# EasyEDA schematic GSE Analog Remote TOP Schematic v1 EasyEDA.json
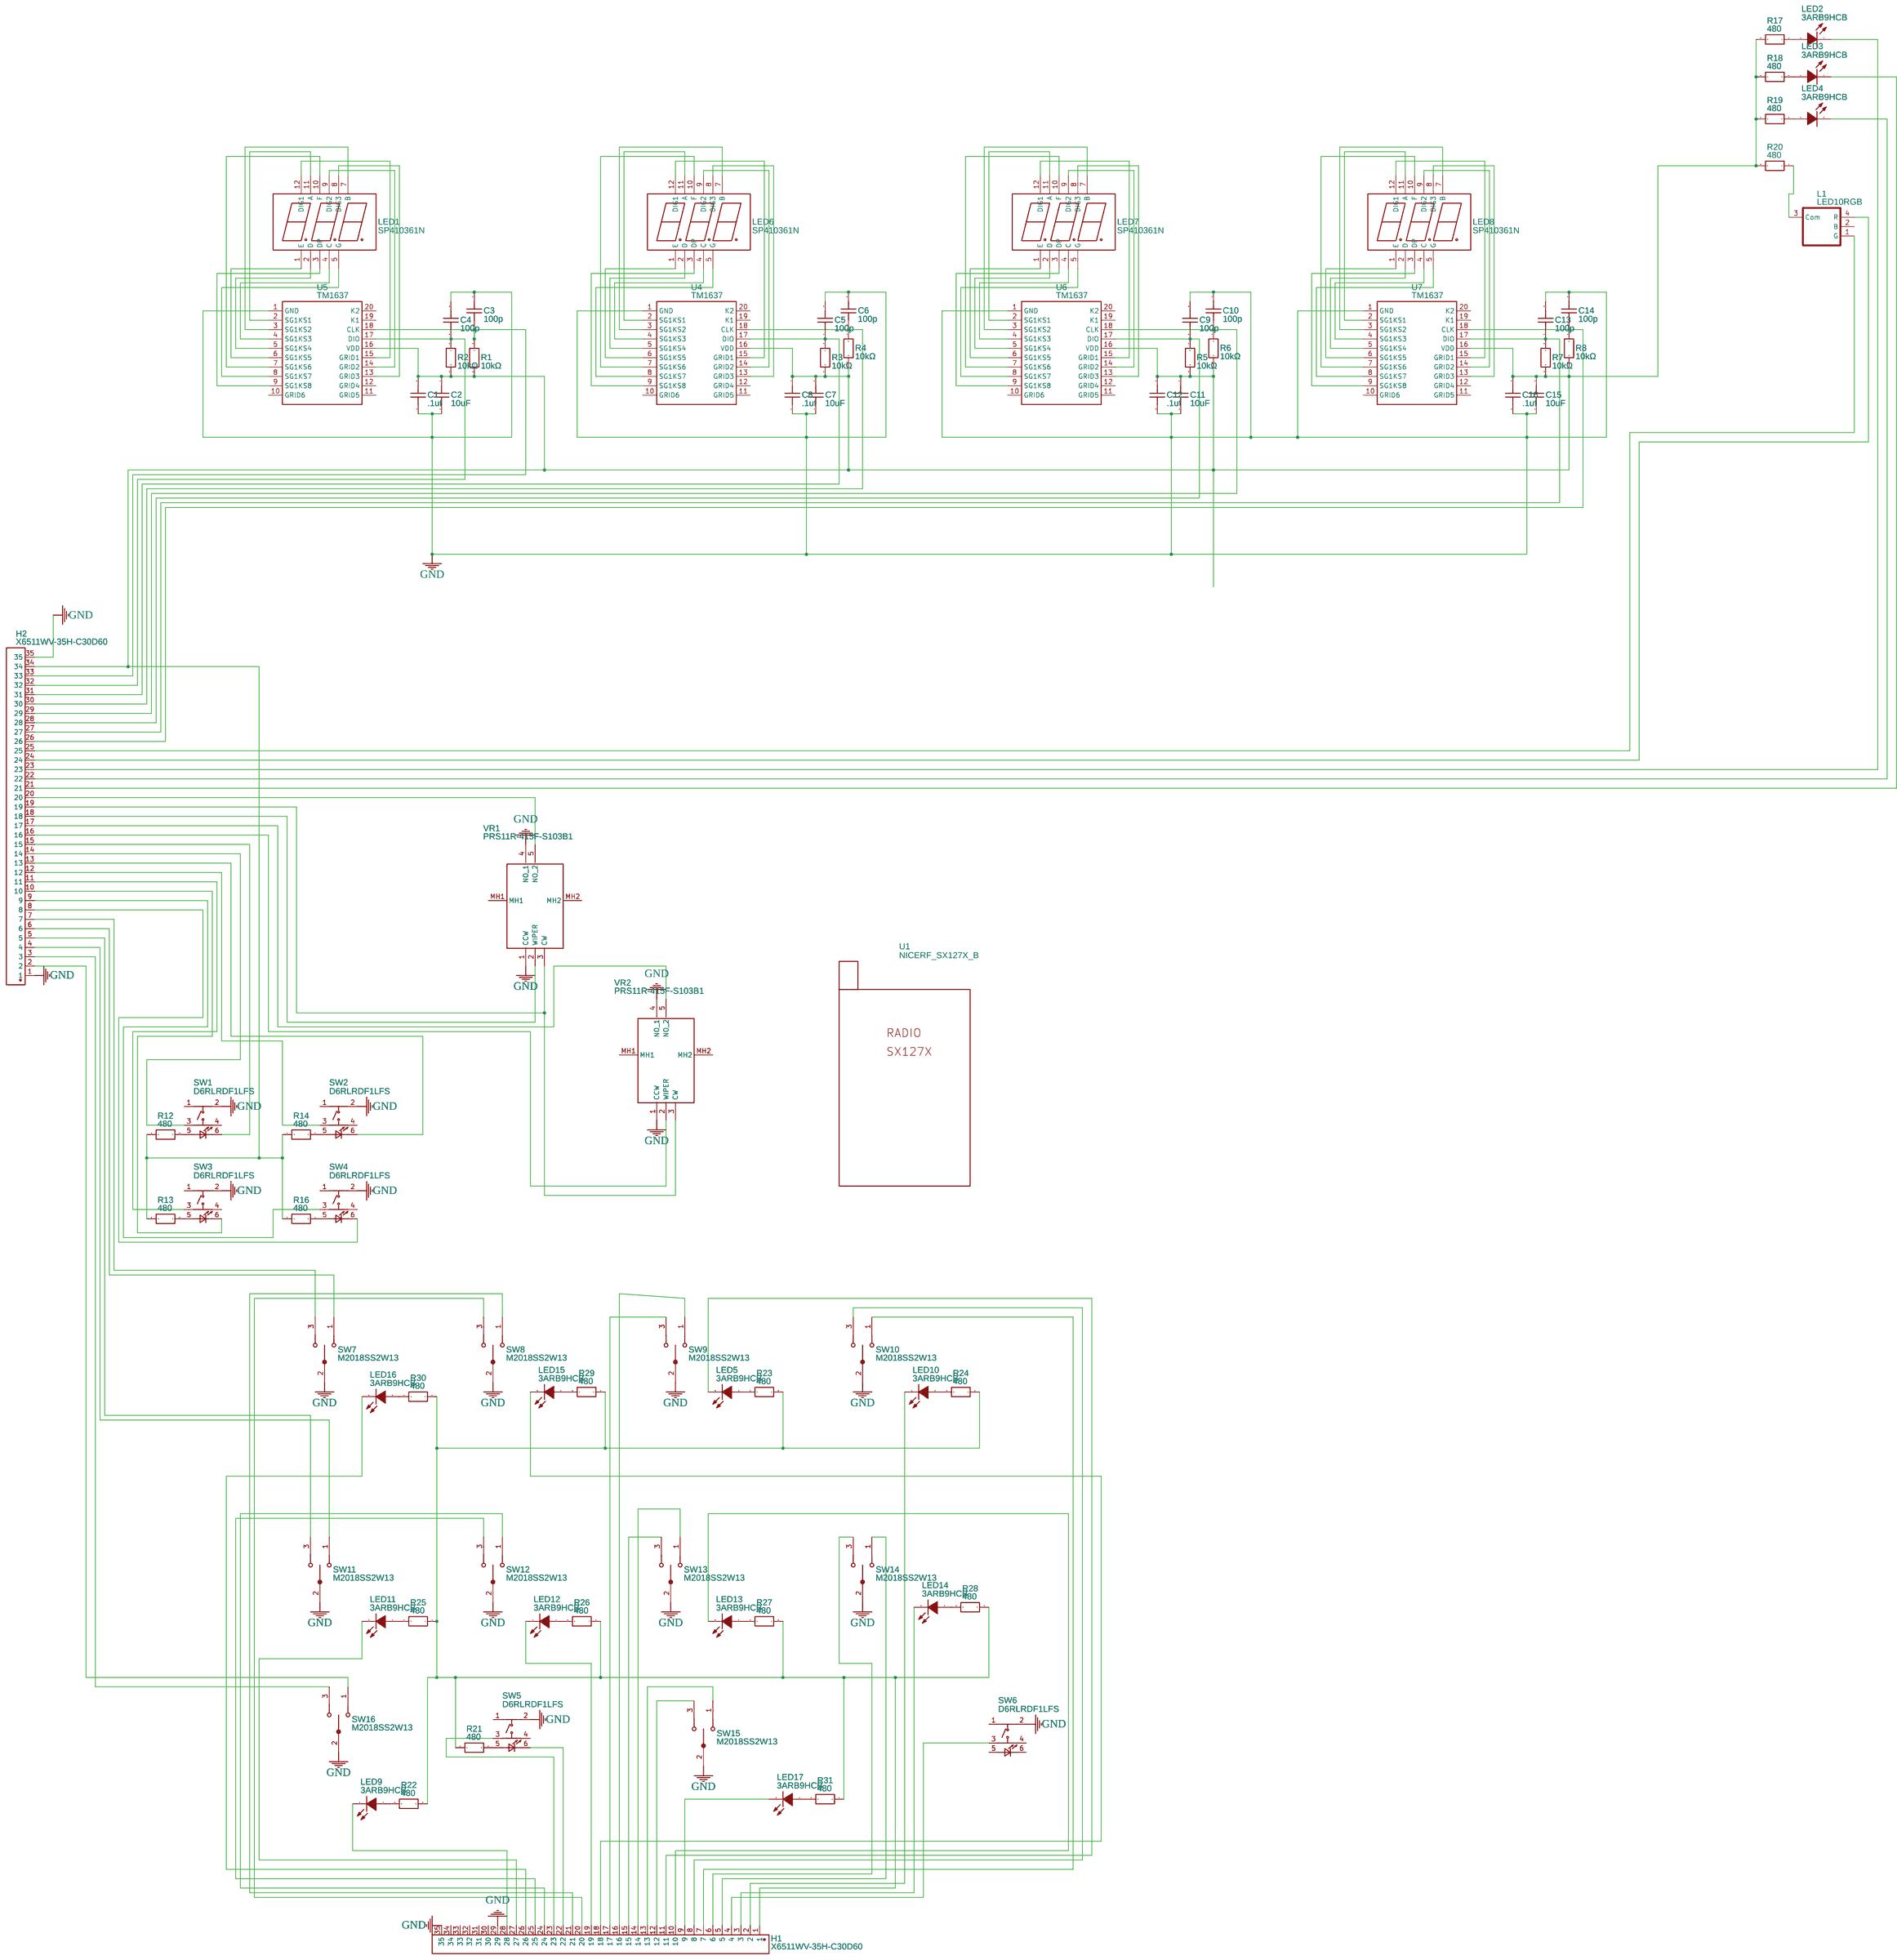
[diagram p0: schematic sheet]

## Parts
C1  .1uf  [C0603]
C2  10uF  [C0603]
C3  100p  [C0603]
C4  100p  [C0603]
C5  100p  [C0603]
C6  100p  [C0603]
C7  10uF  [C0603]
C8  .1uf  [C0603]
C9  100p  [C0603]
C10  100p  [C0603]
C11  10uF  [C0603]
C12  .1uf  [C0603]
C13  100p  [C0603]
C14  100p  [C0603]
C15  10uF  [C0603]
C16  .1uf  [C0603]
H1  X6511WV-35H-C30D60  [HDR-TH_35P-P2.54-V-M]
H2  X6511WV-35H-C30D60  [HDR-TH_35P-P2.54-V-M]
L1  LED10RGB  [LED10MM_RGB]
LED1  SP410361N  [LED-SEG-TH_11P-L22.0-W14.0-P2.54-S10.16-BL]
LED2  3ARB9HCB  [LED-3MM]
LED3  3ARB9HCB  [LED-3MM]
LED4  3ARB9HCB  [LED-3MM]
LED5  3ARB9HCB  [LED-3MM]
LED6  SP410361N  [LED-SEG-TH_11P-L22.0-W14.0-P2.54-S10.16-BL]
LED7  SP410361N  [LED-SEG-TH_11P-L22.0-W14.0-P2.54-S10.16-BL]
LED8  SP410361N  [LED-SEG-TH_11P-L22.0-W14.0-P2.54-S10.16-BL]
LED9  3ARB9HCB  [LED-3MM]
LED10  3ARB9HCB  [LED-3MM]
LED11  3ARB9HCB  [LED-3MM]
LED12  3ARB9HCB  [LED-3MM]
LED13  3ARB9HCB  [LED-3MM]
LED14  3ARB9HCB  [LED-3MM]
LED15  3ARB9HCB  [LED-3MM]
LED16  3ARB9HCB  [LED-3MM]
LED17  3ARB9HCB  [LED-3MM]
R1  10kΩ  [R0603]
R2  10kΩ  [R0603]
R3  10kΩ  [R0603]
R4  10kΩ  [R0603]
R5  10kΩ  [R0603]
R6  10kΩ  [R0603]
R7  10kΩ  [R0603]
R8  10kΩ  [R0603]
R12  480  [R0805]
R13  480  [R0805]
R14  480  [R0805]
R16  480  [R0805]
R17  480  [R0805]
R18  480  [R0805]
R19  480  [R0805]
R20  480  [R0805]
R21  480  [R0805]
R22  480  [R0805]
R23  480  [R0805]
R24  480  [R0805]
R25  480  [R0805]
R26  480  [R0805]
R27  480  [R0805]
R28  480  [R0805]
R29  480  [R0805]
R30  480  [R0805]
R31  480  [R0805]
SW1  D6RLRDF1LFS  [SW-TH_D6RLRDF1LFS]
SW2  D6RLRDF1LFS  [SW-TH_D6RLRDF1LFS]
SW3  D6RLRDF1LFS  [SW-TH_D6RLRDF1LFS]
SW4  D6RLRDF1LFS  [SW-TH_D6RLRDF1LFS]
SW5  D6RLRDF1LFS  [SW-TH_D6RLRDF1LFS]
SW6  D6RLRDF1LFS  [SW-TH_D6RLRDF1LFS]
SW7  M2018SS2W13  [M2012SS2W13]
SW8  M2018SS2W13  [M2012SS2W13]
SW9  M2018SS2W13  [M2012SS2W13]
SW10  M2018SS2W13  [M2012SS2W13]
SW11  M2018SS2W13  [M2012SS2W13]
SW12  M2018SS2W13  [M2012SS2W13]
SW13  M2018SS2W13  [M2012SS2W13]
SW14  M2018SS2W13  [M2012SS2W13]
SW15  M2018SS2W13  [M2012SS2W13]
SW16  M2018SS2W13  [M2012SS2W13]
U1  NICERF_SX127X_B  [NICERF_LORA611PRO_FP_B]
U4  TM1637  [SOP-20_L12.8-W7.5-P1.27-LS10.4-BL]
U5  TM1637  [SOP-20_L12.8-W7.5-P1.27-LS10.4-BL]
U6  TM1637  [SOP-20_L12.8-W7.5-P1.27-LS10.4-BL]
U7  TM1637  [SOP-20_L12.8-W7.5-P1.27-LS10.4-BL]
VR1  PRS11R-415F-S103B1  [PRS11R-415F-S103B1FP]
VR2  PRS11R-415F-S103B1  [PRS11R-415F-S103B1FP]

## Library data of the parts
C1-C16 = 10UF: Contributor: LCSC; Supplier: LCSC; Supplier Part: C15415; Manufacturer: SAMSUNG(三星); JLCPCB Part Class: Extended Part
H1 H2 = X6511WV-35H-C30D60: Contributor: LCSC; Supplier: LCSC; Supplier Part: C2883694; Manufacturer: XKB Connectivity(中国星坤)
L1 = LED10RGB: Contributor: sorinfxdx
LED1 LED6-LED8 = SP410361N: Contributor: LCSC; Supplier: LCSC; Supplier Part: C98923; Manufacturer: ARKLED(方舟); JLCPCB Part Class: Extended Part
LED2-LED5 LED9-LED17 = 3ARB9HCB: Supplier: LCSC; Manufacturer: KENTO; Supplier Part: C42016
R1-R8 = RE0603FRE0710KL: Contributor: LCSC; Supplier: LCSC; Supplier Part: C723398; Manufacturer: YAGEO(国巨); JLCPCB Part Class: Extended Part
R12-R14 R16-R31 = ERA6AEB202V: Supplier: LCSC; Supplier Part: C417117; Manufacturer: PANASONIC; Contributor: LCSC
SW1-SW6 = D6RLRDF1LFS: Contributor: LCSC; Supplier: LCSC; Supplier Part: C966901; Manufacturer: C&K; JLCPCB Part Class: Extended Part
SW7-SW16 = M2018SS2W13: Contributor: Tomasejackson
U1 = NICERF_SX127X_B: Contributor: mbrinker
U4-U7 = TM1637: Contributor: Tinkerforge; Supplier: LCSC; Manufacturer: TM(天微); Supplier Part: C20001; JLCPCB Part Class: Extended Part
VR1 VR2 = PRS11R-415F-S103B1: Contributor: mbrinker; Manufacturer: BOURNS; link: https://www.newark.com/bourns/prs11r-415f-s103b1/rotary-potentiometer-10kohm-0/dp/65AH0673

## Nets
GND: C1.1 C2.1 C3.2 C4.2 C5.2 C6.2 C7.1 C8.1 C9.2 C10.2 C11.1 C12.1 C13.2 C14.2 C15.1 C16.1 H1.29 H1.35 H2.1 H2.35 SW1.2 SW2.2 SW3.2 SW4.2 SW5.2 SW6.2 SW7.2 SW8.2 SW9.2 SW10.2 SW11.2 SW12.2 SW13.2 SW14.2 SW15.2 SW16.2 U4.1(GND) U5.1(GND) U6.1(GND) U7.1(GND) VR1.1(CCW) VR1.4(NO_1) VR2.1(CCW) VR2.4(NO_1)
Net-(C1-2): C1.2 C2.2 C7.2 C8.2 C11.2 C12.2 C15.2 C16.2 H2.34 R1.2 R2.2 R3.2 R4.2 R5.2 R6.2 R7.2 R8.2 R12.2 R13.2 R14.2 R16.2 R17.2 R18.2 R19.2 R20.2 U4.16(VDD) U5.16(VDD) U6.16(VDD) U7.16(VDD)
Net-(C3-1): C3.1 H2.33 R1.1 U5.18(CLK)
Net-(C4-1): C4.1 H2.32 R2.1 U5.17(DIO)
Net-(C5-1): C5.1 H2.31 R3.1 U4.17(DIO)
Net-(C6-1): C6.1 H2.30 R4.1 U4.18(CLK)
Net-(C9-1): C9.1 H2.28 R5.1 U6.17(DIO)
Net-(C10-1): C10.1 H2.29 R6.1 U6.18(CLK)
Net-(C13-1): C13.1 H2.27 R7.1 U7.17(DIO)
Net-(C14-1): C14.1 H2.26 R8.1 U7.18(CLK)
Net-(H1-1): H1.1 R21.2 R22.1 R23.1 R24.1 R25.1 R26.1 R27.1 R28.1 R29.1 R30.1 R31.1
Net-(H1-2): H1.2 LED10.2(K)
Net-(H1-3): H1.3 LED14.2(K)
Net-(H1-4): H1.4 SW6.3
Net-(H1-5): H1.5 SW14.1
Net-(H1-6): H1.6 SW14.3
Net-(H1-7): H1.7 SW10.1
Net-(H1-8): H1.8 SW10.3
Net-(H1-9): H1.9 LED17.2(K)
Net-(H1-10): H1.10 LED13.2(K)
Net-(H1-11): H1.11 LED5.2(K)
Net-(H1-12): H1.12 SW15.3
Net-(H1-13): H1.13 SW15.1
Net-(H1-14): H1.14 SW13.1
Net-(H1-15): H1.15 SW13.3
Net-(H1-16): H1.16 SW9.1
Net-(H1-17): H1.17 SW9.3
Net-(H1-18): H1.18 LED15.2(K)
Net-(H1-19): H1.19 LED12.2(K)
Net-(H1-20): H1.20 SW8.3
Net-(H1-21): H1.21 SW8.1
Net-(H1-22): H1.22 SW5.6
Net-(H1-23): H1.23 SW5.3
Net-(H1-24): H1.24 SW12.1
Net-(H1-25): H1.25 SW12.3
Net-(H1-26): H1.26 LED16.2(K)
Net-(H1-27): H1.27 LED11.2(K)
Net-(H1-28): H1.28 LED9.2(K)
Net-(H2-2): H2.2 SW16.1
Net-(H2-3): H2.3 SW16.3
Net-(H2-4): H2.4 SW11.1
Net-(H2-5): H2.5 SW11.3
Net-(H2-6): H2.6 SW7.1
Net-(H2-7): H2.7 SW7.3
Net-(H2-8): H2.8 SW4.6
Net-(H2-9): H2.9 SW4.3
Net-(H2-10): H2.10 SW3.6
Net-(H2-11): H2.11 SW3.3
Net-(H2-12): H2.12 SW2.3
Net-(H2-13): H2.13 SW2.6
Net-(H2-14): H2.14 SW1.3
Net-(H2-15): H2.15 SW1.6
Net-(H2-16): H2.16 VR2.2(WIPER)
Net-(H2-17): H2.17 VR2.5(NO_2)
Net-(H2-18): H2.18 VR1.2(WIPER)
Net-(H2-19): H2.19 VR1.3(CW) VR2.3(CW)
Net-(H2-20): H2.20 VR1.5(NO_2)
Net-(H2-21): H2.21 LED3.2(K)
Net-(H2-22): H2.22 LED4.2(K)
Net-(H2-23): H2.23 LED2.2(K)
Net-(H2-24): H2.24 L1.4(R)
Net-(H2-25): H2.25 L1.1(G)
Net-(L1-3): L1.3(Com) R20.1
Net-(LED1-1): LED1.1(E) U5.6(SG1KS5)
Net-(LED1-2): LED1.2(D) U5.5(SG1KS4)
Net-(LED1-3): LED1.3(DP) U5.9(SG1KS8)
Net-(LED1-4): LED1.4(C) U5.4(SG1KS3)
Net-(LED1-5): LED1.5(G) U5.8(SG1KS7)
Net-(LED1-7): LED1.7(B) U5.3(SG1KS2)
Net-(LED1-8): LED1.8(DIG3) U5.13(GRID3)
Net-(LED1-9): LED1.9(DIG2) U5.14(GRID2)
Net-(LED1-10): LED1.10(F) U5.7(SG1KS6)
Net-(LED1-11): LED1.11(A) U5.2(SG1KS1)
Net-(LED1-12): LED1.12(DIG1) U5.15(GRID1)
Net-(LED2-1): LED2.1(A) R17.1
Net-(LED3-1): LED3.1(A) R18.1
Net-(LED4-1): LED4.1(A) R19.1
Net-(LED5-1): LED5.1(A) R23.2
Net-(LED6-1): LED6.1(E) U4.6(SG1KS5)
Net-(LED6-2): LED6.2(D) U4.5(SG1KS4)
Net-(LED6-3): LED6.3(DP) U4.9(SG1KS8)
Net-(LED6-4): LED6.4(C) U4.4(SG1KS3)
Net-(LED6-5): LED6.5(G) U4.8(SG1KS7)
Net-(LED6-7): LED6.7(B) U4.3(SG1KS2)
Net-(LED6-8): LED6.8(DIG3) U4.13(GRID3)
Net-(LED6-9): LED6.9(DIG2) U4.14(GRID2)
Net-(LED6-10): LED6.10(F) U4.7(SG1KS6)
Net-(LED6-11): LED6.11(A) U4.2(SG1KS1)
Net-(LED6-12): LED6.12(DIG1) U4.15(GRID1)
Net-(LED7-1): LED7.1(E) U6.6(SG1KS5)
Net-(LED7-2): LED7.2(D) U6.5(SG1KS4)
Net-(LED7-3): LED7.3(DP) U6.9(SG1KS8)
Net-(LED7-4): LED7.4(C) U6.4(SG1KS3)
Net-(LED7-5): LED7.5(G) U6.8(SG1KS7)
Net-(LED7-7): LED7.7(B) U6.3(SG1KS2)
Net-(LED7-8): LED7.8(DIG3) U6.13(GRID3)
Net-(LED7-9): LED7.9(DIG2) U6.14(GRID2)
Net-(LED7-10): LED7.10(F) U6.7(SG1KS6)
Net-(LED7-11): LED7.11(A) U6.2(SG1KS1)
Net-(LED7-12): LED7.12(DIG1) U6.15(GRID1)
Net-(LED8-1): LED8.1(E) U7.6(SG1KS5)
Net-(LED8-2): LED8.2(D) U7.5(SG1KS4)
Net-(LED8-3): LED8.3(DP) U7.9(SG1KS8)
Net-(LED8-4): LED8.4(C) U7.4(SG1KS3)
Net-(LED8-5): LED8.5(G) U7.8(SG1KS7)
Net-(LED8-7): LED8.7(B) U7.3(SG1KS2)
Net-(LED8-8): LED8.8(DIG3) U7.13(GRID3)
Net-(LED8-9): LED8.9(DIG2) U7.14(GRID2)
Net-(LED8-10): LED8.10(F) U7.7(SG1KS6)
Net-(LED8-11): LED8.11(A) U7.2(SG1KS1)
Net-(LED8-12): LED8.12(DIG1) U7.15(GRID1)
Net-(LED9-1): LED9.1(A) R22.2
Net-(LED10-1): LED10.1(A) R24.2
Net-(LED11-1): LED11.1(A) R25.2
Net-(LED12-1): LED12.1(A) R26.2
Net-(LED13-1): LED13.1(A) R27.2
Net-(LED14-1): LED14.1(A) R28.2
Net-(LED15-1): LED15.1(A) R29.2
Net-(LED16-1): LED16.1(A) R30.2
Net-(LED17-1): LED17.1(A) R31.2
Net-(R12-1): R12.1 SW1.5
Net-(R13-1): R13.1 SW3.5
Net-(R14-1): R14.1 SW2.5
Net-(R16-1): R16.1 SW4.5
Net-(R21-1): R21.1 SW5.5

Not connected (* = marked no-connect by the designer): H1 30 31 32 33 34; L1 2(B); SW1 1 4; SW2 1 4; SW3 1 4; SW4 1 4; SW5 1 4; SW6 1 4 5 6; U4 10(GRID6) 11(GRID5) 12(GRID4) 19(K1) 20(K2); U5 10(GRID6) 11(GRID5) 12(GRID4) 19(K1) 20(K2); U6 10(GRID6) 11(GRID5) 12(GRID4) 19(K1) 20(K2); U7 10(GRID6) 11(GRID5) 12(GRID4) 19(K1) 20(K2); VR1 MH1 MH2; VR2 MH1 MH2
